# EAGLE schematic schema_carte_US (EAGLE 6.4)
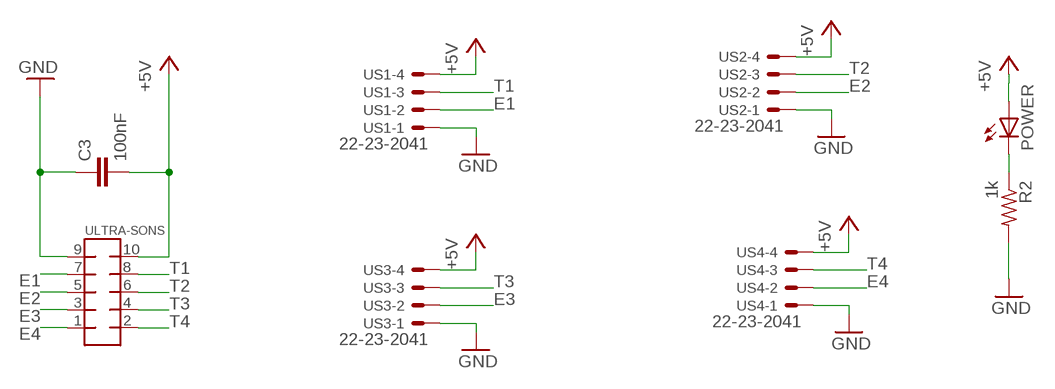
[diagram p0: schematic, sheet 1]

## Parts
C3  100nF  C-EUC0805  [C0805]
POWER  LEDCHIPLED_0805  [CHIPLED_0805]
R2  1k  R-US_M0805  [M0805]
ULTRA-SONS  MMATCH-10-PTH  [AMP-215079-10]
US1  22-23-2041  [22-23-2041]
US2  22-23-2041  [22-23-2041]
US3  22-23-2041  [22-23-2041]
US4  22-23-2041  [22-23-2041]

## Nets
+5V: C3.2 POWER.A ULTRA-SONS.10 US1.4 US2.4 US3.4 US4.4
E1: ULTRA-SONS.7 US1.2
E2: ULTRA-SONS.5 US2.2
E3: ULTRA-SONS.3 US3.2
E4: ULTRA-SONS.1 US4.2
GND: C3.1 R2.2 ULTRA-SONS.9 US1.1 US2.1 US3.1 US4.1
N$2: POWER.C R2.1
T1: ULTRA-SONS.8 US1.3
T2: ULTRA-SONS.6 US2.3
T3: ULTRA-SONS.4 US3.3
T4: ULTRA-SONS.2 US4.3

## Library data of the parts
C3 = rcl:C-EU: CAPACITOR, European symbol
POWER = led:LED: LED OSRAM: - CHIPLED LG R971, LG N971, LY N971, LG Q971, LY Q971, LO R971, LY R971 LH N974, LH R974 LS Q976, LO Q976, LY Q976 LO Q996 - Hyper CHIPLED LW Q18S LB Q993, LB Q99A, LB R99A - SideLED LS A670, LO A670, LY A670, LG A670, LP A670 LB A673, LV A673, LT A673, LW A673 LH A674 LY A675 LS A676, LA A676, LO A676, LY A676, LW A676 LS A679, LY A679, LG A679 - Hyper Micro SIDELED® LS Y876, LA Y876, LO Y876, LY Y876 LT Y87S - SmartLED LW L88C, LW L88S LB L89C, LB L89S, LG L890 LS L89K, LO L89K, LY L89K LS L896, LA L896, LO L896, LY L896 - TOPLED LS T670, LO T670, LY T670, LG T670, LP T670 LSG T670, LSP T670, LSY T670, LOP T670, LYG T670 LG T671, LOG T671, LSG T671 LB T673, LV T673, LT T673, LW T673 LH T674 LS T676, LA T676, LO T676, LY T676, LB T676, LH T676, LSB T676, LW T676 LB T67C, LV T67C, LT T67C, LS T67K, LO T67K, LY T67K, LW E67C LS E67B, LA E67B, LO E67B, LY E67B, LB E67C, LV E67C, LT E67C LW T67C LS T679, LY T679, LG T679 LS T770, LO T770, LY T770, LG T770, LP T770 LB T773, LV T773, LT T773, LW T773 LH T774 LS E675, LA E675, LY E675, LS T675 LS T776, LA T776, LO T776, LY T776, LB T776 LHGB T686 LT T68C, LB T68C - Hyper Mini TOPLED® LB M676 - Mini TOPLED Santana® LG M470 LS M47K, LO M47K, LY M47K Source: http://www.osram.convergy.de LUXEON: - LUMILED® LXK2-PW12-R00, LXK2-PW12-S00, LXK2-PW14-U00, LXK2-PW14-V00 LXK2-PM12-R00, LXK2-PM12-S00, LXK2-PM14-U00 LXK2-PE12-Q00, LXK2-PE12-R00, LXK2-PE12-S00, LXK2-PE14-T00, LXK2-PE14-U00 LXK2-PB12-K00, LXK2-PB12-L00, LXK2-PB12-M00, LXK2-PB14-N00, LXK2-PB14-P00, LXK2-PB14-Q00 LXK2-PR12-L00, LXK2-PR12-M00, LXK2-PR14-Q00, LXK2-PR14-R00 LXK2-PD12-Q00, LXK2-PD12-R00, LXK2-PD12-S00 LXK2-PH12-R00, LXK2-PH12-S00 LXK2-PL12-P00, LXK2-PL12-Q00, LXK2-PL12-R00 Source: www.luxeon.com KINGBRIGHT: KA-3528ASYC Source: www.kingbright.com
R2 = rcl:R-US_: RESISTOR, American symbol
ULTRA-SONS = jt-con-micromatch:MMATCH-10-*: AMP Micromatch 10-pin
US1-US4 = con-molex:22-23-2041: .100" (2.54mm) Center Header - 4 Pin; MF: MOLEX; MPN: 22-23-2041; OC_FARNELL: 1462920; OC_NEWARK: 38C0355